# Altium schematic sheet IRIS2_PCB_FrontPlate.SchDoc
size A4; SheetNumber: 1; SheetTotal: 1
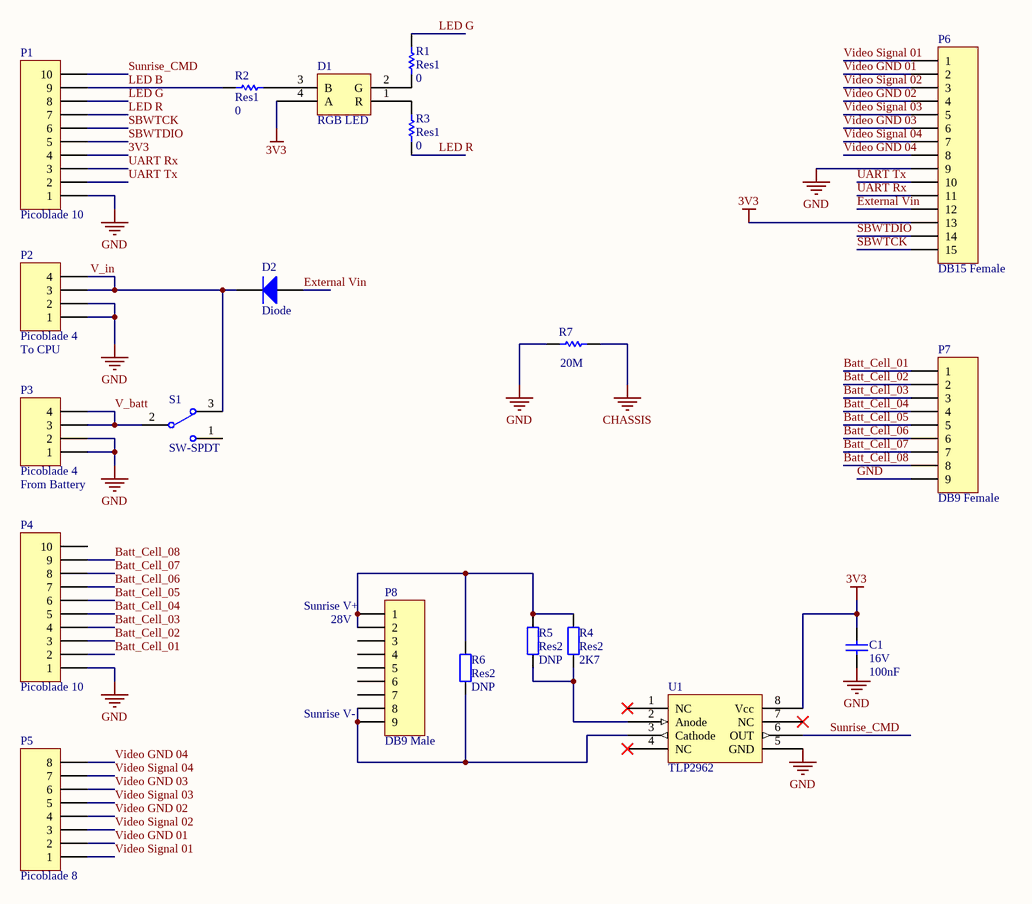
[diagram p0: IRIS2_PCB_FrontPlate.SchDoc]

## Parts
C1  16V  value 100nF  [0402]
D1  RGB LED  [PCBComponent_1]
D2  Diode  [SMC]
P1  Picoblade 10  [53047-1010]
P2  Picoblade 4  [53047-0410]
P3  Picoblade 4  [53047-0410]
P4  Picoblade 10  [53047-1010]
P5  Picoblade 8  [53047-0810]
P6  DB15 Female  [DB15 Female 191-015-213]
P7  DB9 Female  [DB9 Female 191-009-213]
P8  DB9 Male  [DB9 Male 621-009-668-032]
R1  Res1  value 0  [J1-0603]
R2  Res1  value 0  [J1-0603]
R3  Res1  value 0  [J1-0603]
R4  Res2  value 2K7  [C1210_M]
R5  Res2  value DNP  [C1210_M]
R6  Res2  value DNP  [C1210_M]
R7  value 20M  [6-0805_N]  (hidden comment: Res1)
S1  SW-SPDT  [CS12ANW03]
U1  TLP2962  [SOIC127P600X135-8N]

## Nets
3V3: C1.1 D1.4(A) P1.4 P6.13 U1.8(Vcc)
CHASSIS: R7.2
GND: C1.2 P1.1 P2.1 P2.2 P3.1 P3.2 P4.1 P6.9 P7.9 R7.1 U1.5(GND)
Batt_Cell_01: P4.2 P7.1
Batt_Cell_02: P4.3 P7.2
Batt_Cell_03: P4.4 P7.3
Batt_Cell_04: P4.5 P7.4
Batt_Cell_05: P4.6 P7.5
Batt_Cell_06: P4.7 P7.6
Batt_Cell_07: P4.8 P7.7
Batt_Cell_08: P4.9 P7.8
External Vin: D2.1(A) P6.12
LED B: P1.9 R2.2
LED G: P1.8 R1.1
LED R: P1.7 R3.1
SBWTCK: P1.6 P6.15
SBWTDIO: P1.5 P6.14
Sunrise_CMD: P1.10 U1.6(OUT)
UART Rx: P1.3 P6.11
UART Tx: P1.2 P6.10
V_batt: P3.3 P3.4 S1.2
V_in: D2.2(K) P2.3 P2.4 S1.3
Video GND 01: P5.2 P6.2
Video GND 02: P5.4 P6.4
Video GND 03: P5.6 P6.6
Video GND 04: P5.8 P6.8
Video Signal 01: P5.1 P6.1
Video Signal 02: P5.3 P6.3
Video Signal 03: P5.5 P6.5
Video Signal 04: P5.7 P6.7
NetD1_1: D1.1(R) R3.2
NetD1_2: D1.2(G) R1.2
NetD1_3: D1.3(B) R2.1
NetP8_1: P8.1 P8.2 R4.1 R5.1 R6.1
NetP8_8: P8.8 P8.9 R6.2 U1.3(Cathode)
NetR4_2: R4.2 R5.2 U1.2(Anode)

Not connected (* = marked no-connect by the designer): P4 10; P8 3 4 5 6 7; S1 1; U1 1(NC)* 4(NC)* 7(NC)*

## Notes on the sheet
- (near P2) To CPU
- (near P3) From Battery
- (near P8) Sunrise V+
- (near P8) 28V
- (near P8) Sunrise V-

## Library data of the parts
C1 = Cap: Capacitor; Manufacturer: Murata; Reference: GCM155R71C104KA55D; Published: 8-Jun-2000; LatestRevisionDate: 17-Jul-2002; LatestRevisionNote: Re-released for DXP Platform.; PackageReference: RAD-0.3; Publisher: Altium Limited; PackageDescription: Radial Cap, Thru-Hole; 2 Leads; 0.3 in Pin Spacing
D1 = RGB LED: Manufacturer: Wurth Elektronik; Reference: 156125M173000
D2 = Diode: Default Diode; Published: 8-Jun-2000; LatestRevisionDate: 17-Jul-2002; LatestRevisionNote: Re-released for DXP Platform.; PackageVersion: Sep-1996; PackageReference: SMC; Publisher: Altium Limited; PackageDescription: DO-214-AB/SMC; 2 C-Bend Leads; Body 7.9 x 5.9 mm, inc. leads (LxW); Code_JEDEC: DO-214-AB
P1 P4 = Header 10: Header, 10-Pin; Manufacturer: Molex; Reference: 530471010
P2 P3 = Header 4: Header, 4-Pin; Manufacturer: Molex; Reference: 0530470410; LatestRevisionDate: 17-Jul-2002; LatestRevisionNote: Re-released for DXP Platform.; Publisher: Altium Limited
P5 = Header 8: Header, 8-Pin; Manufacturer: Molex; Reference: 0530470810
P6 = Header 15: Header, 15-Pin; Manufacturer: NorComp; Reference: 191-015-223R001
P7 = Header 9: Header, 9-Pin; Manufacturer: NorComp; Reference: 191-009-113L551
P8 = Header 9: Header, 9-Pin; Manufacturer: EDAC; Reference: 621-009-668-032
R1-R3 = Res1: Resistor; Manufacturer: Panasonic; Reference: ERJ-3GEY0R00V; Published: 8-Jun-2000; LatestRevisionDate: 17-Jul-2002; LatestRevisionNote: Re-released for DXP Platform.; PackageReference: AXIAL-0.3; Publisher: Altium Limited; PackageDescription: Axial Device, Thru-Hole; 2 Leads; 0.3 in Pin Spacing
R4 = Res2: Resistor; Manufacturer: TE Connectivity; Reference: CRGP1210F2K7; Foot: 1210/3225
R5 R6 = Res2: Resistor; Foot: 1210/3225
R7 = Res1: Resistor; Manufacturer: KOA; Reference: RK73B2ATTD206J; LatestRevisionDate: 17-Jul-2002; LatestRevisionNote: Re-released for DXP Platform.; PackageReference: AXIAL-0.3; Publisher: Altium Limited; PackageDescription: Axial Device, Thru-Hole; 2 Leads; 0.3 in Pin Spacing; Supplier 1: Mouser; Supplier Part Number 1: 667-ERJ-2RKF1002X
S1 = SW-SPDT: SPDT Subminiature Toggle Switch, Right Angle Mounting, Vertical Actuation; Manufacturer: NKK Switches; ComponentLink1Description: Manufacturer Link; ComponentLink1URL: http://www.apem.com; Reference: CS12ANW03
U1 = TLP2962: Optocoupler; Manufacturer: Toshiba; Reference: TLP2962(TP1,F); Foot: SMD-8